# Altium schematic sheet RAM.SchDoc: RAM
size A4; Author: Ben Eater; DrawnBy: LittleYe233; SheetNumber: 7; SheetTotal: 6
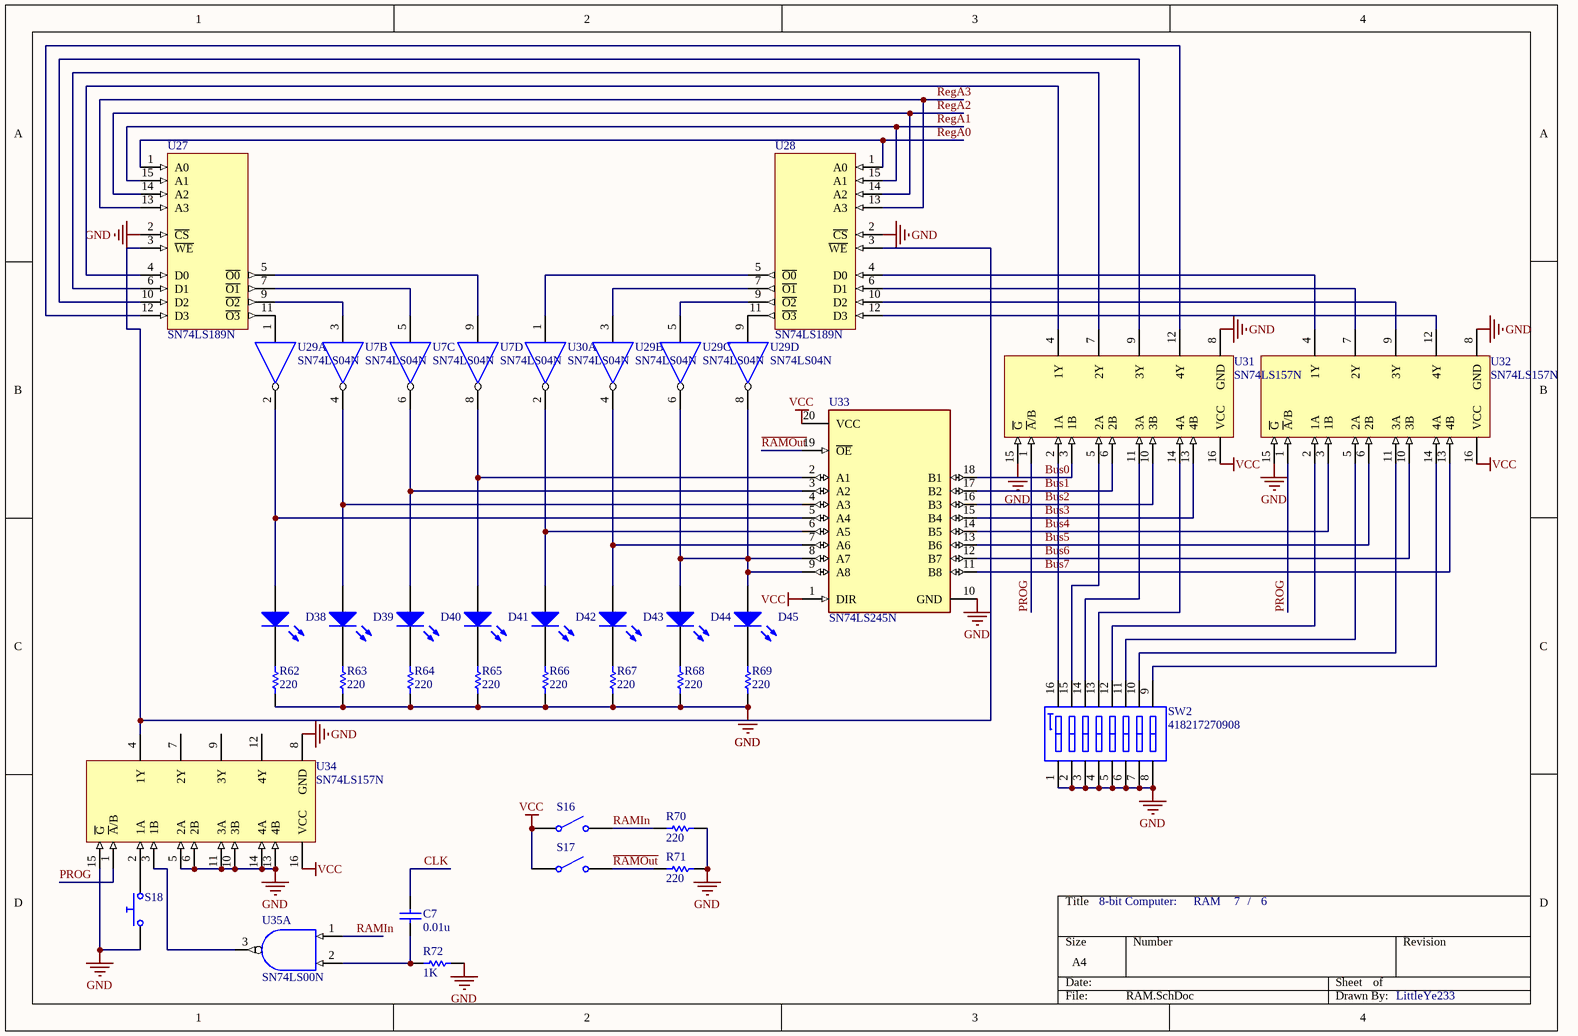
[diagram p0: RAM.SchDoc]

## Parts
C7  value 0.01u  (hidden comment: Capacitor)
D38  Light-Emitting Diode  (value not drawn)
D39  Light-Emitting Diode  (value not drawn)
D40  Light-Emitting Diode  (value not drawn)
D41  Light-Emitting Diode  (value not drawn)
D42  Light-Emitting Diode  (value not drawn)
D43  Light-Emitting Diode  (value not drawn)
D44  Light-Emitting Diode  (value not drawn)
D45  Light-Emitting Diode  (value not drawn)
R62  value 220  (hidden comment: Resistor)
R63  value 220  (hidden comment: Resistor)
R64  value 220  (hidden comment: Resistor)
R65  value 220  (hidden comment: Resistor)
R66  value 220  (hidden comment: Resistor)
R67  value 220  (hidden comment: Resistor)
R68  value 220  (hidden comment: Resistor)
R69  value 220  (hidden comment: Resistor)
R70  value 220  (hidden comment: Resistor)
R71  value 220  (hidden comment: Resistor)
R72  value 1K  (hidden comment: Resistor)
S16  Single-Pole, Single-Throw Switch  (value not drawn)
S17  Single-Pole, Single-Throw Switch  (value not drawn)
S18  Push Button Normally Opened  (value not drawn)
SW2  418217270908  [418217270908]
U7  SN74LS04N  [N0014A]  (parts B,C,D of 7)
U27  SN74LS189N
U28  SN74LS189N
U29  SN74LS04N  [N0014A]  (parts A,B,C,D of 7)
U30  SN74LS04N  [N0014A]  (part A of 7)
U31  SN74LS157N  [N0016A]
U32  SN74LS157N  [N0016A]
U33  SN74LS245N  [FP-N0020A-MFG]
U34  SN74LS157N  [N0016A]
U35  SN74LS00N  [N0014A]  (part A of 5)

## Nets
GND: R62.1 R63.1 R64.1 R65.1 R66.1 R67.1 R68.1 R69.1 R70.1 R71.1 R72.2 S18.1 SW2.1 SW2.2 SW2.3 SW2.4 SW2.5 SW2.6 SW2.7 SW2.8 U27.2(~{CS}) U28.2(~{CS}) U31.8(GND) U31.15(~{G}) U32.8(GND) U32.15(~{G}) U33.10(GND) U34.5(2A) U34.6(2B) U34.8(GND) U34.10(3B) U34.11(3A) U34.13(4B) U34.14(4A) U34.15(~{G})
VCC: S16.1 S17.1 U31.16(VCC) U32.16(VCC) U33.1(DIR) U33.20(VCC) U34.16(VCC)
Bus0: U31.3(1B) U33.18(B1)
Bus1: U31.6(2B) U33.17(B2)
Bus2: U31.10(3B) U33.16(B3)
Bus3: U31.13(4B) U33.15(B4)
Bus4: U32.3(1B) U33.14(B5)
Bus5: U32.6(2B) U33.13(B6)
Bus6: U32.10(3B) U33.12(B7)
Bus7: U32.13(4B) U33.11(B8)
CLK: C7.2
PROG: U31.1(~{A}/B) U32.1(~{A}/B) U34.1(~{A}/B)
~{RAMOut}: R71.2 S17.2 U33.19(~{OE})
RAMIn: R70.2 S16.2 U35.1(1A)
RegA0: U27.1(A0) U28.1(A0)
RegA1: U27.15(A1) U28.15(A1)
RegA2: U27.14(A2) U28.14(A2)
RegA3: U27.13(A3) U28.13(A3)
NetC7_1: C7.1 R72.1 U35.2(1B)
NetD38_1: D38.1(A) U29.2(~{1Y}) U33.5(A4)
NetD38_2: D38.2(K) R62.2
NetD39_1: D39.1(A) U7.4(~{2Y}) U33.4(A3)
NetD39_2: D39.2(K) R63.2
NetD40_1: D40.1(A) U7.6(~{3Y}) U33.3(A2)
NetD40_2: D40.2(K) R64.2
NetD41_1: D41.1(A) U7.8(~{4Y}) U33.2(A1)
NetD41_2: D41.2(K) R65.2
NetD42_1: D42.1(A) U30.2(~{1Y}) U33.6(A5)
NetD42_2: D42.2(K) R66.2
NetD43_1: D43.1(A) U29.4(~{2Y}) U33.7(A6)
NetD43_2: D43.2(K) R67.2
NetD44_1: D44.1(A) D45.1(A) U29.6(~{3Y}) U29.8(~{4Y}) U33.8(A7) U33.9(A8)
NetD44_2: D44.2(K) R68.2
NetD45_2: D45.2(K) R69.2
NetS18_2: S18.2 U34.2(1A)
NetSW2_9: SW2.9 U32.14(4A)
NetSW2_10: SW2.10 U32.11(3A)
NetSW2_11: SW2.11 U32.5(2A)
NetSW2_12: SW2.12 U32.2(1A)
NetSW2_13: SW2.13 U31.14(4A)
NetSW2_14: SW2.14 U31.11(3A)
NetSW2_15: SW2.15 U31.5(2A)
NetSW2_16: SW2.16 U31.2(1A)
NetU7_3: U7.3(2A) U27.9(~{O2})
NetU7_5: U7.5(3A) U27.7(~{O1})
NetU7_9: U7.9(4A) U27.5(~{O0})
NetU27_3: U27.3(~{WE}) U28.3(~{WE}) U34.4(1Y)
NetU27_4: U27.4(D0) U31.4(1Y)
NetU27_6: U27.6(D1) U31.7(2Y)
NetU27_10: U27.10(D2) U31.9(3Y)
NetU27_11: U27.11(~{O3}) U29.1(1A)
NetU27_12: U27.12(D3) U31.12(4Y)
NetU28_4: U28.4(D0) U32.4(1Y)
NetU28_5: U28.5(~{O0}) U30.1(1A)
NetU28_6: U28.6(D1) U32.7(2Y)
NetU28_7: U28.7(~{O1}) U29.3(2A)
NetU28_9: U28.9(~{O2}) U29.5(3A)
NetU28_10: U28.10(D2) U32.9(3Y)
NetU28_11: U28.11(~{O3}) U29.9(4A)
NetU28_12: U28.12(D3) U32.12(4Y)
NetU34_3: U34.3(1B) U35.3(1Y)

Not connected (* = marked no-connect by the designer): U34 7(2Y) 9(3Y) 12(4Y)

## Notes on the sheet
- 8-bit Computer:
- /

## Library data of the parts
C7 = Capacitor: SimulationGenericComponent: True
D38-D45 = LED: AF: 1; BV: 0; BV_MAX: 1e99; EG: 1.11; FC: 0.5; IBV: 0.001; IS: 1e-14; MJSW: 0.33; NTUN: 30; TNOM: 27; XTI: 3; SimulationGenericComponent: True; CJO: 0; CJP: 0; CTA: 0; CTP: 0; FCS: 0.5; FV_MAX: 1e99; IKF: 0; IKR: 0; ISR: 1e-14; JSW: 0; JTUN: 0; JTUNSW: 0; KEG: 1; KF: 0; LEVEL: 1; N: 1; NBV: 1; NR: 1; NS: 1; PHP: 1; RS: 0; TCV: 0; TLEV: 0; TLEVC: 0; TM1: 0; TM2: 0; TPB: 0; TPHP: 0; TRS: 0; TRS2: 0; TT: 0; TTT1: 0; TTT2: 0; VJ: 1; XTITUN: 3
R62-R72 = Resistor: TC1: 0; SimulationGenericComponent: True; TC2: 0
S16 S17 = SPST SW: closed: 0; Rclosed: 1m; Ropen: 1Meg; SimulationGenericComponent: True
S18 = Push Button NO: closed: 0; Rclosed: 1m; Ropen: 1Meg; SimulationGenericComponent: True
SW2 = CMP-1441-00017-1: WS-DITU 2.54 mm right angled compact THT Dip Switch with raised actuator; Manufacturer: Wuerth Elektronik; NoPins: 16; ComponentLink2URL: http://katalog.we-online.de/em/datasheet/4182172709xx.pdf; ComponentLink2Description: Datasheet; PartNumber: 418217270908; PackageReference: 418217270908; ComponentLink1URL: http://www.we-online.com; ComponentLink1Description: Manufacturer URL
U7 U29 U30 = CMP-1615-00911-2: Hex inverters, N0014A, TUBE; Manufacturer: Texas Instruments; Output Drive (IOL/IOH)(Max)(mA): -0.4/8; Schmitt Trigger: No; F @ Nom Voltage(Max)(Mhz): 35; Voltage(Nom)(V): 5; Technology Family: LS; Input Type: TTL; Output Type: CMOS; Bits(#): 6; VCC(Max)(V): 5.25; ICC @ Nom Voltage(Max)(mA): 0.033; Rating: Catalog; VCC(Min)(V): 4.75; tpd @ Nom Voltage(Max)(ns): 22; Operating Temperature Range(C): 0 to 70; DatasheetVersion: SDLS029C; Generic Part Number: SN74LS04; Code_JEDEC: MS-001; PackageReference: N0014A
U31 U32 U34 = CMP-1633-00683-2: Quadruple 2-Line To 1-Line Data Selectors/Multiplexers, N0016A, TUBE; Manufacturer: Texas Instruments; Configuration: 2：1; Voltage(Nom)(V): 5; ICC @ Nom Voltage(Max)(mA): 16; VCC(Min)(V): 4.75; Channels(#): 4; Rating: Military; tpd @ Nom Voltage(Max)(ns): 14; F @ Nom Voltage(Max)(Mhz): 35; Technology Family: LS; Output Drive (IOL/IOH)(Max)(mA): 8/-0.4; Function: Encoder/Multiplexer; Schmitt Trigger: No; VCC(Max)(V): 5.25; Generic Part Number: SN74LS157; DatasheetVersion: SDLS058; Code_JEDEC: MS-001; Operating Temperature Range(C): 0 to 70; Type: Standard; PackageReference: N0016A
U33 = CMP-1620-00419-3: IC TXRX NON-INVERT 5.25V 20DIP; Number of Bits per Element: 8; Polarity: Non-Inverting; Low Level Output Current: 24mA; Propagation Delay: 12ns; Min Supply Voltage: 4.75V; Number of Elements: 1; Quiescent Current: 62mA; Logic Function: Transceiver; Direction: Bidirectional; Operating Supply Voltage: 5V; High Level Output Current: -15mA; Mount: Through Hole; Min Operating Temperature: 0°C; Number of Outputs: 8; Max Operating Temperature: 70°C; Max Supply Voltage: 5.25V; Width: 6.35mm; Number of Pins: 20; RoHS Compliant: Yes; Turn-On Delay Time: 12ns; Termination: Through Hole; Number of Channels: 8; Number of Circuits: 8; Weight: 0.042297oz; Package Quantity: 20; Number of Transceivers: 8; Length: 24.33mm; Height: 4.57mm; REACH SVHC: No SVHC; Contact Plating: Gold; Number of Bits: 8; Lead Free: Lead Free; Case/Package: PDIP; Packaging: Rail/Tube; Radiation Hardening: No
U35 = CMP-1627-00476-2: Quad 2-input positive-NAND gates, N0014A, TUBE; Manufacturer: Texas Instruments; VCC(Min)(V): 4.75; F @ Nom Voltage(Max)(Mhz): 35; Voltage(Nom)(V): 5; Rating: Catalog; tpd @ Nom Voltage(Max)(ns): 22; Output Type: TTL; Schmitt Trigger: No; Output Drive (IOL/IOH)(Max)(mA): 0.4/-16; Technology Family: LS; ICC @ Nom Voltage(Max)(mA): 0.022; VCC(Max)(V): 5.25; Bits(#): 4; Code_JEDEC: MS-001; Generic Part Number: SN74LS00; Input Type: TTL; Operating Temperature Range(C): 0 to 70; PackageReference: N0014A; DatasheetVersion: SDLS025B